# Altium schematic sheet 1_top.SchDoc: =ProjectTitle
size A4; Address1: github.com/4pplet/Steezy60; Address2: Licence: CERN-OHL-S; SheetNumber: 1; SheetTotal: 4
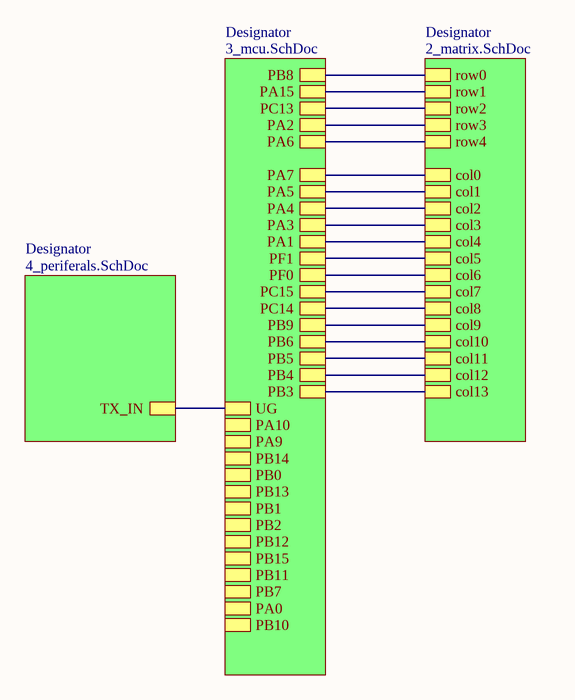
[diagram p0: 1_top.SchDoc]

## Sub-sheets
Designator = 2_matrix.SchDoc: col11, col13, col6, col8, col12, col5, col0, col10, col7, col3, col2, col1, col4, row0, col9, row3, row1, row4, row2
Designator = 3_mcu.SchDoc: PB5, PB6, PB4, PB0, PB7, PB3, PB2, PB1, PC13, PA2, PA0, PA1, PA9, PC15, PA15, PA10, PC14, PF1, UG, PA7, PA6, PA5, PA4, PA3, PB15, PB12, PB13, PB11, PB8, PB10, PB9, PB14, PF0
Designator = 4_periferals.SchDoc: TX_IN

## Nets
(unnamed): sheet Designator/col11, sheet Designator/PB5
(unnamed): sheet Designator/col13, sheet Designator/PB3
(unnamed): sheet Designator/col6, sheet Designator/PF0
(unnamed): sheet Designator/col8, sheet Designator/PC14
(unnamed): sheet Designator/col12, sheet Designator/PB4
(unnamed): sheet Designator/col5, sheet Designator/PF1
(unnamed): sheet Designator/col0, sheet Designator/PA7
(unnamed): sheet Designator/col10, sheet Designator/PB6
(unnamed): sheet Designator/col7, sheet Designator/PC15
(unnamed): sheet Designator/col3, sheet Designator/PA3
(unnamed): sheet Designator/col2, sheet Designator/PA4
(unnamed): sheet Designator/col1, sheet Designator/PA5
(unnamed): sheet Designator/col4, sheet Designator/PA1
(unnamed): sheet Designator/row0, sheet Designator/PB8
(unnamed): sheet Designator/col9, sheet Designator/PB9
(unnamed): sheet Designator/row3, sheet Designator/PA2
(unnamed): sheet Designator/row1, sheet Designator/PA15
(unnamed): sheet Designator/row4, sheet Designator/PA6
(unnamed): sheet Designator/row2, sheet Designator/PC13
(unnamed): sheet Designator/UG, sheet Designator/TX_IN

## Notes on the sheet
- Title
- Size:
- Date:
- A4
- Number:
- Time:
- Revision:
- Sheet
- of
- File: